# EAGLE design ethernetHAT (EAGLE 9.6.2)
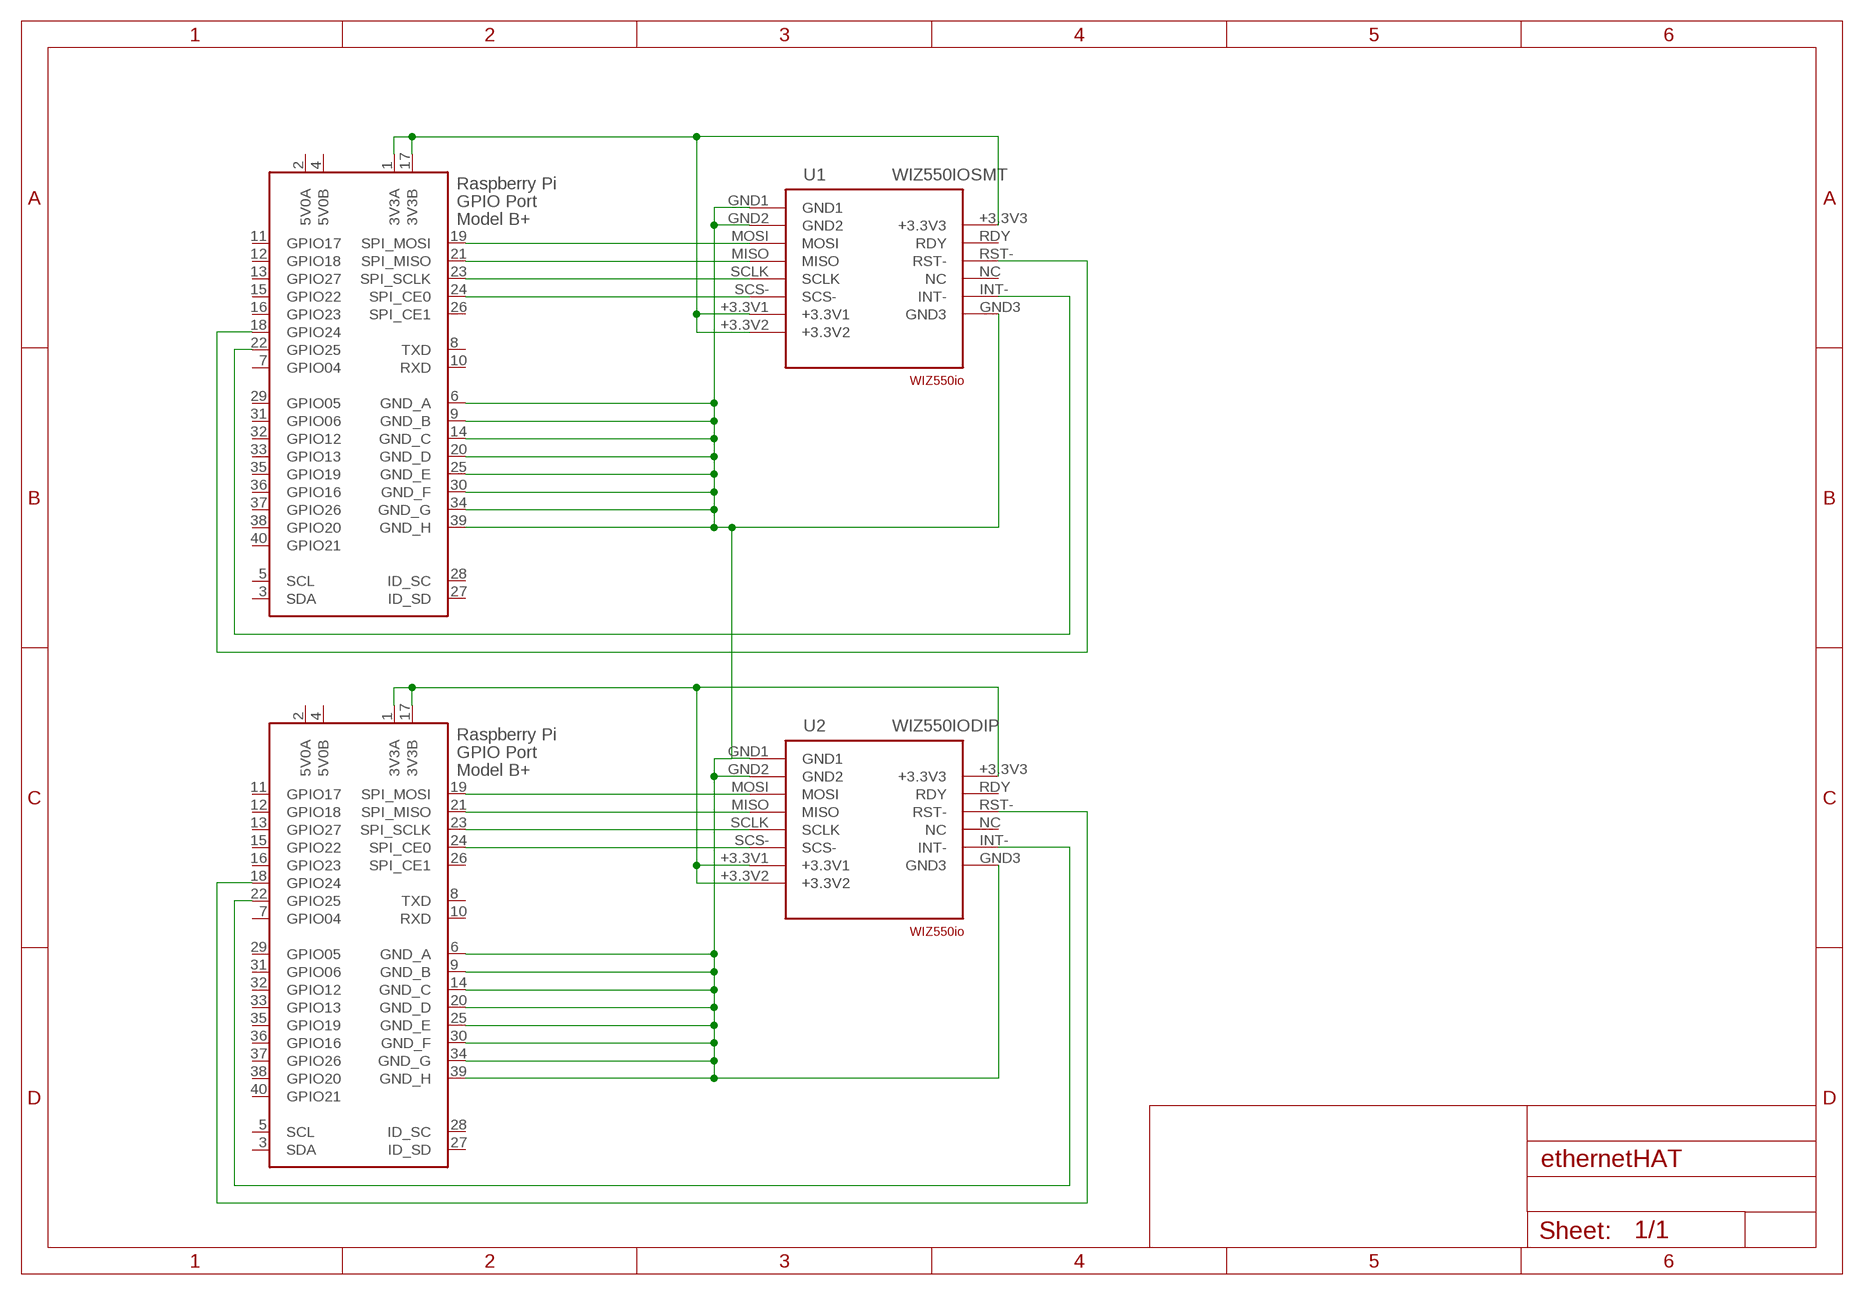
[diagram p0: schematic, sheet 1]

## Parts
U1  WIZ550IOSMT  [WIZ550IO]
U2  WIZ550IODIP  [WIZ550IO_A]
X1  RASPI_GPIO_B+#_PIN  [RASPI_GPIO_B+_PIN]
X2  RASPI_GPIO_B+#_PIN  [RASPI_GPIO_B+_PIN]

## Nets
3V3B: U2.+3.3V1 U2.+3.3V2 U2.+3.3V3 X2.1(3V3A) X2.17(3V3B)
GND: U1.GND1 U1.GND2 U1.GND3 U2.GND1 U2.GND2 U2.GND3 X1.6(GND_A) X1.9(GND_B) X1.14(GND_C) X1.20(GND_D) X1.25(GND_E) X1.30(GND_F) X1.34(GND_G) X1.39(GND_H) X2.6(GND_A) X2.9(GND_B) X2.14(GND_C) X2.20(GND_D) X2.25(GND_E) X2.30(GND_F) X2.34(GND_G) X2.39(GND_H)
INT-: U1.INT- X1.22(GPIO25)
MOSI: U1.MOSI X1.19(SPI_MOSI)
MSOI: U1.MISO X1.21(SPI_MISO)
N$5: U2.MOSI X2.19(SPI_MOSI)
N$6: U2.MISO X2.21(SPI_MISO)
N$7: U2.SCLK X2.23(SPI_SCLK)
N$8: U2.SCS- X2.24(SPI_CE0)
N$10: U2.RST- X2.18(GPIO24)
N$11: U2.INT- X2.22(GPIO25)
RST-: U1.RST- X1.18(GPIO24)
SCLK: U1.SCLK X1.23(SPI_SCLK)
SCS-: U1.SCS- X1.24(SPI_CE0)
VCC: U1.+3.3V1 U1.+3.3V2 U1.+3.3V3 X1.1(3V3A) X1.17(3V3B)
Unconnected: U1.NC U1.RDY U2.NC U2.RDY X1.3(SDA) X1.5(SCL) X1.7(GPIO04) X1.8(TXD) X1.10(RXD) X1.11(GPIO17) X1.12(GPIO18) X1.13(GPIO27) X1.15(GPIO22) X1.16(GPIO23) X1.26(SPI_CE1) X1.27(ID_SD) X1.28(ID_SC) X1.29(GPIO05) X1.31(GPIO06) X1.32(GPIO12) X1.33(GPIO13) X1.35(GPIO19) X1.36(GPIO16) X1.37(GPIO26) X1.38(GPIO20) X1.40(GPIO21) X2.3(SDA) X2.5(SCL) X2.7(GPIO04) X2.8(TXD) X2.10(RXD) X2.11(GPIO17) X2.12(GPIO18) X2.13(GPIO27) X2.15(GPIO22) X2.16(GPIO23) X2.26(SPI_CE1) X2.27(ID_SD) X2.28(ID_SC) X2.29(GPIO05) X2.31(GPIO06) X2.32(GPIO12) X2.33(GPIO13) X2.35(GPIO19) X2.36(GPIO16) X2.37(GPIO26) X2.38(GPIO20) X2.40(GPIO21)

## Power pins joined to a net without a drawn wire
5V0A: X1.2(5V0A) X2.2(5V0A)
5V0B: X1.4(5V0B) X2.4(5V0B)

## Library data of the parts
U1 U2 = WIZ550io:WIZ550IO
X1 X2 = raspberrypi_bastelstube_v13:RASPI_GPIO_B+#: 2x20 header connector, all pins connected

## Board
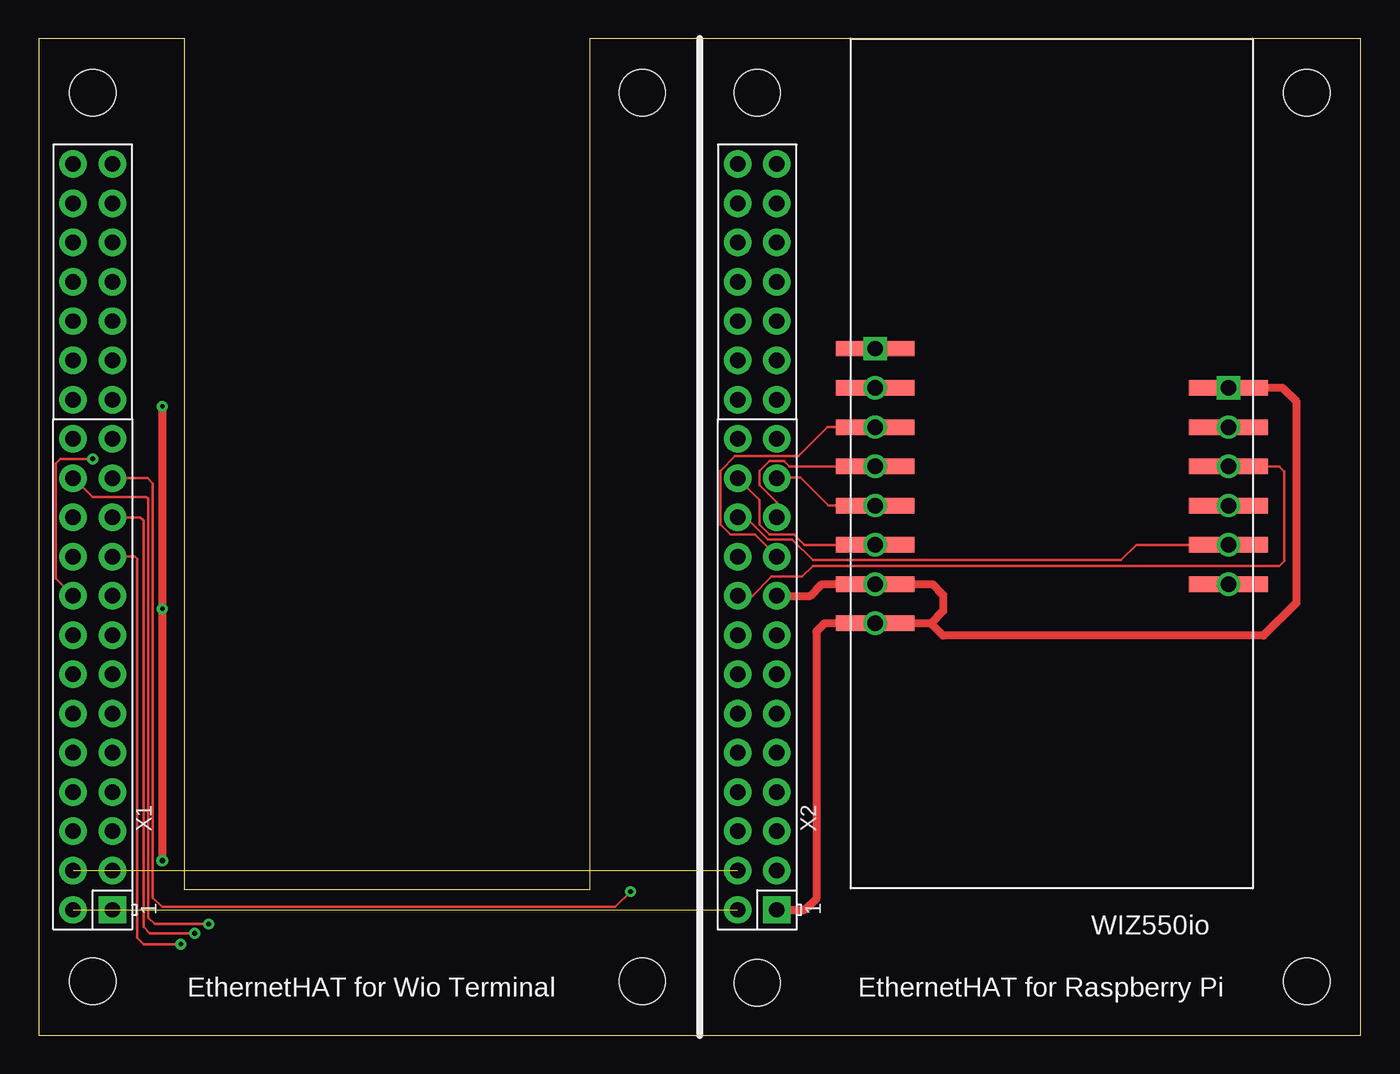
[diagram p1: board, top side]
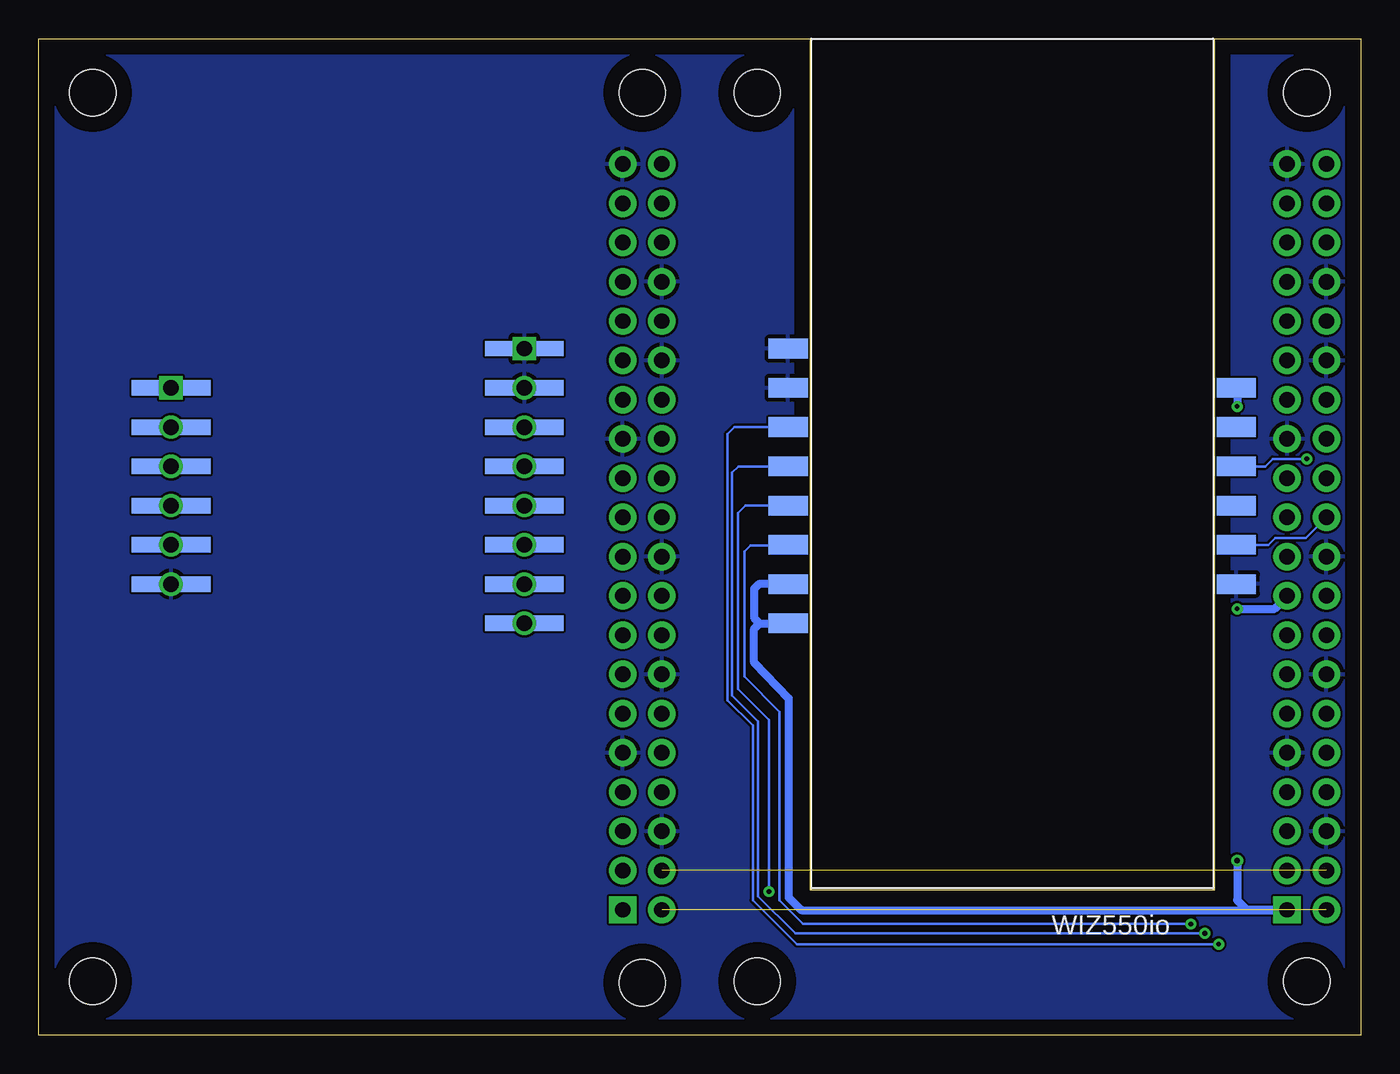
[diagram p2: board, bottom side, seen from below]

Size 85.56 x 64.5 mm. Coordinates in mm from the lower left corner, seen from the top.
Outline: 0,0 85.56,0 85.56,64.5 35.66,64.5 35.66,9.4 9.46,9.4 9.46,64.5 0,64.5 0,0
Copper layers (1*16): Top 0.035mm / dielectric 1.5mm / Bottom 0.035mm
Design rules "default *": minimum track width 6mil, minimum drill 0.3mm, track to track 6mil, track to pad 6mil, pad to pad 6mil, via to via 6mil, smd to smd 6mil, copper to edge 40mil, drill to drill 6mil, minimum pad ring 10mil, minimum via ring 8mil, stop-mask expansion 4mil, vias tented up to drill 0mil, thermal gap 10mil
Holes 3 mm at 3.5,3.5 39.06,3.5 39.06,61 3.5,61 46.5,3.4 46.5,61 82.06,61 82.06,3.5

### Footprints (pad centres in the part's own frame; a part is rotated, then mirrored left to right if it is on the bottom)
WIZ550IO = smd 2.54 x 1.27: +3.3V1 -14.5,-7.8; +3.3V2 -14.5,-10.34; +3.3V3 14.5,4.9; GND1 -14.5,7.44; GND2 -14.5,4.9; GND3 14.5,-7.8; INT- 14.5,-5.26; MISO -14.5,-0.18; MOSI -14.5,2.36; NC 14.5,-2.72; RDY 14.5,2.36; RST- 14.5,-0.18; SCLK -14.5,-2.72; SCS- -14.5,-5.26
WIZ550IO_A = drill 1: +3.3V1 -11.43,-7.8; +3.3V2 -11.43,-10.34; GND2 -11.43,4.9; GND3 11.43,-7.8; INT- 11.43,-5.26; MISO -11.43,-0.18; MOSI -11.43,2.36; NC 11.43,-2.72; RDY 11.43,2.36; RST- 11.43,-0.18; SCLK -11.43,-2.72; SCS- -11.43,-5.26 | drill 1 square: +3.3V3 11.43,4.9; GND1 -11.43,7.44 | smd 5.1 x 1: P$1 -11.43,-10.34; P$2 -11.43,-7.8; P$3 -11.43,-5.26; P$4 -11.43,-2.72; P$5 -11.43,-0.18; P$6 -11.43,2.36; P$7 -11.43,4.9; P$8 -11.43,7.44; P$9 11.43,4.9; P$10 11.43,2.36; P$11 11.43,-0.18; P$12 11.43,-2.72; P$13 11.43,-5.26; P$14 11.43,-7.8 | smd 5.1 x 1 bottom: P$15 -11.43,-10.34; P$16 -11.43,-7.8; P$17 -11.43,-5.26; P$18 -11.43,-2.72; P$19 -11.43,-0.18; P$20 -11.43,2.36; P$21 -11.43,4.9; P$22 -11.43,7.44; P$23 11.43,4.9; P$24 11.43,2.36; P$25 11.43,-0.18; P$26 11.43,-2.72; P$27 11.43,-5.26; P$28 11.43,-7.8
RASPI_GPIO_B+_PIN = drill 1 pad 1.778 square: 1 -24.13,-1.27 | drill 1 pad 1.778: 2 -24.13,1.27; 3 -21.59,-1.27; 4 -21.59,1.27; 5 -19.05,-1.27; 6 -19.05,1.27; 7 -16.51,-1.27; 8 -16.51,1.27; 9 -13.97,-1.27; 10 -13.97,1.27; 11 -11.43,-1.27; 12 -11.43,1.27; 13 -8.89,-1.27; 14 -8.89,1.27; 15 -6.35,-1.27; 16 -6.35,1.27; 17 -3.81,-1.27; 18 -3.81,1.27; 19 -1.27,-1.27; 20 -1.27,1.27; 21 1.27,-1.27; 22 1.27,1.27; 23 3.81,-1.27; 24 3.81,1.27; 25 6.35,-1.27; 26 6.35,1.27; 27 8.89,-1.27; 28 8.89,1.27; 29 11.43,-1.27; 30 11.43,1.27; 31 13.97,-1.27; 32 13.97,1.27; 33 16.51,-1.27; 34 16.51,1.27; 35 19.05,-1.27; 36 19.05,1.27; 37 21.59,-1.27; 38 21.59,1.27; 39 24.13,-1.27; 40 24.13,1.27

### Placement (x,y rotation side)
U1  22.56,37 0 bottom
U2  65.56,37 0 top
X1  3.5,32.25 90 top
X2  46.5,32.25 90 top

### Tracks (layer width: path | path; a pad name or v marks a point on that pad's centre or on a via)
3V3B
  Top 0.508: X2.17 49.94,28.44 50.7,29.2 U2.+3.3V1 57.83,29.2 58.53,28.5 58.53,27.46 57.73,26.66 | 57.73,26.66 U2.+3.3V2 50.86,26.66 50.33,26.13 50.33,8.82 49.59,8.12 X2.1 | 57.73,26.66 58.53,25.86 79.26,25.86 81.4,28 81.4,41 80.5,41.9 U2.+3.3V3
5V0A  (1 unrouted)
5V0B  (1 unrouted)
GND
  pour Bottom: -0.1,-0.1 -0.1,64.6 85.7,64.6 85.7,-0.1
INT-
  Bottom 0.152: U1.INT- 5.99,31.74 5.53,32.2 3.55,32.2 X1.22
MOSI  (via drill 0.3)
  Top 0.152: X1.19 6.22,30.98 6.39,30.82 6.39,6.31 6.8,5.9 v9.2,5.9
  Bottom 0.152: U1.MOSI 40.54,39.36 40.99,38.91 40.99,21.69 39.35,20.05 39.35,8.75 36.49,5.9 v9.2,5.9
MSOI  (via drill 0.3)
  Top 0.152: X1.21 6.59,33.52 6.78,33.32 6.78,7.02 7.2,6.6 v10.1,6.6
  Bottom 0.152: U1.MISO 40.28,36.82 40.68,36.42 40.68,21.98 39,20.3 39,9 36.6,6.6 v10.1,6.6
N$5
  Top 0.152: X2.19 46.35,32.4 44.77,32.4 44.11,33.06 44.11,36.52 45.07,37.48 49.15,37.48 51.03,39.36 U2.MOSI
N$6
  Top 0.152: U2.MISO 48.59,36.82 48.23,37.18 47.31,37.18 46.65,36.52 46.65,35.6 47.77,34.48 X2.21
N$7
  Top 0.152: U2.SCLK 51.12,34.28 49.3,36.1 47.81,36.1 X2.23
N$8
  Top 0.152: U2.SCS- 49.55,31.74 48.89,32.4 47.31,32.4 46.65,33.06 46.65,34.64 X2.24
N$10
  Top 0.152: X2.18 46.19,28.44 47.43,29.68 49.4,29.68 50.1,30.38 80.28,30.38 80.6,30.7 80.6,36.5 80.28,36.82 U2.RST-
N$11
  Top 0.152: X2.22 45.76,33.52 47.18,32.1 48.76,32.1 50.1,30.76 70.04,30.76 71.02,31.74 U2.INT-
RST-  (via drill 0.3)
  Top 0.152: v3.5,37.3 1.4,37.3 1.1,37 1.1,29.57 X1.18
  Bottom 0.152: U1.RST- 6.18,36.82 5.7,37.3 v3.5,37.3
SCLK  (via drill 0.3)
  Top 0.152: X1.23 7.06,36.06 7.39,35.72 7.39,8.9 7.99,8.31 37.31,8.31 v38.3,9.3
  Bottom 0.152: U1.SCLK 39.82,34.28 40.3,33.8 40.3,22.4 38.3,20.4 v38.3,9.3
SCS-  (via drill 0.3)
  Top 0.152: X1.24 2.29,36.06 3.51,34.84 6.97,34.84 7.09,34.72 7.09,7.61 7.5,7.2 v11,7.2
  Bottom 0.152: U1.SCS- 37.06,31.7 39.5,31.7 39.9,31.3 39.9,23.22 37.62,20.94 37.62,8.72 36.1,7.2 v11,7.2
VCC  (via drill 0.3, 0.35)
  Top 0.508: v8,40.7 v8,27.6 v8,11.3
  Bottom 0.508: v8,27.6 5.57,27.6 X1.17 | v8,11.3 8,8.75 7.37,8.12 X1.1 4.79,8.1 36.2,8.1 37.02,8.92 37.02,21.82 39.26,24.12 39.26,26.3 38.9,26.66 | U1.+3.3V1 38.96,29.2 39.26,28.9 39.26,27.02 38.9,26.66 | U1.+3.3V3 8,41.86 v8,40.7 | 38.9,26.66 U1.+3.3V2

### Text on the board
tPlace: EthernetHAT for Wio Terminal | EthernetHAT for Raspberry Pi